# Altium project IPG.PrjPcb (part 7 of 13)

## Sheet 10-Sensing.SchDoc: Sensing
size A2; DocumentNumber: 10; SheetNumber: 10; SheetTotal: 15
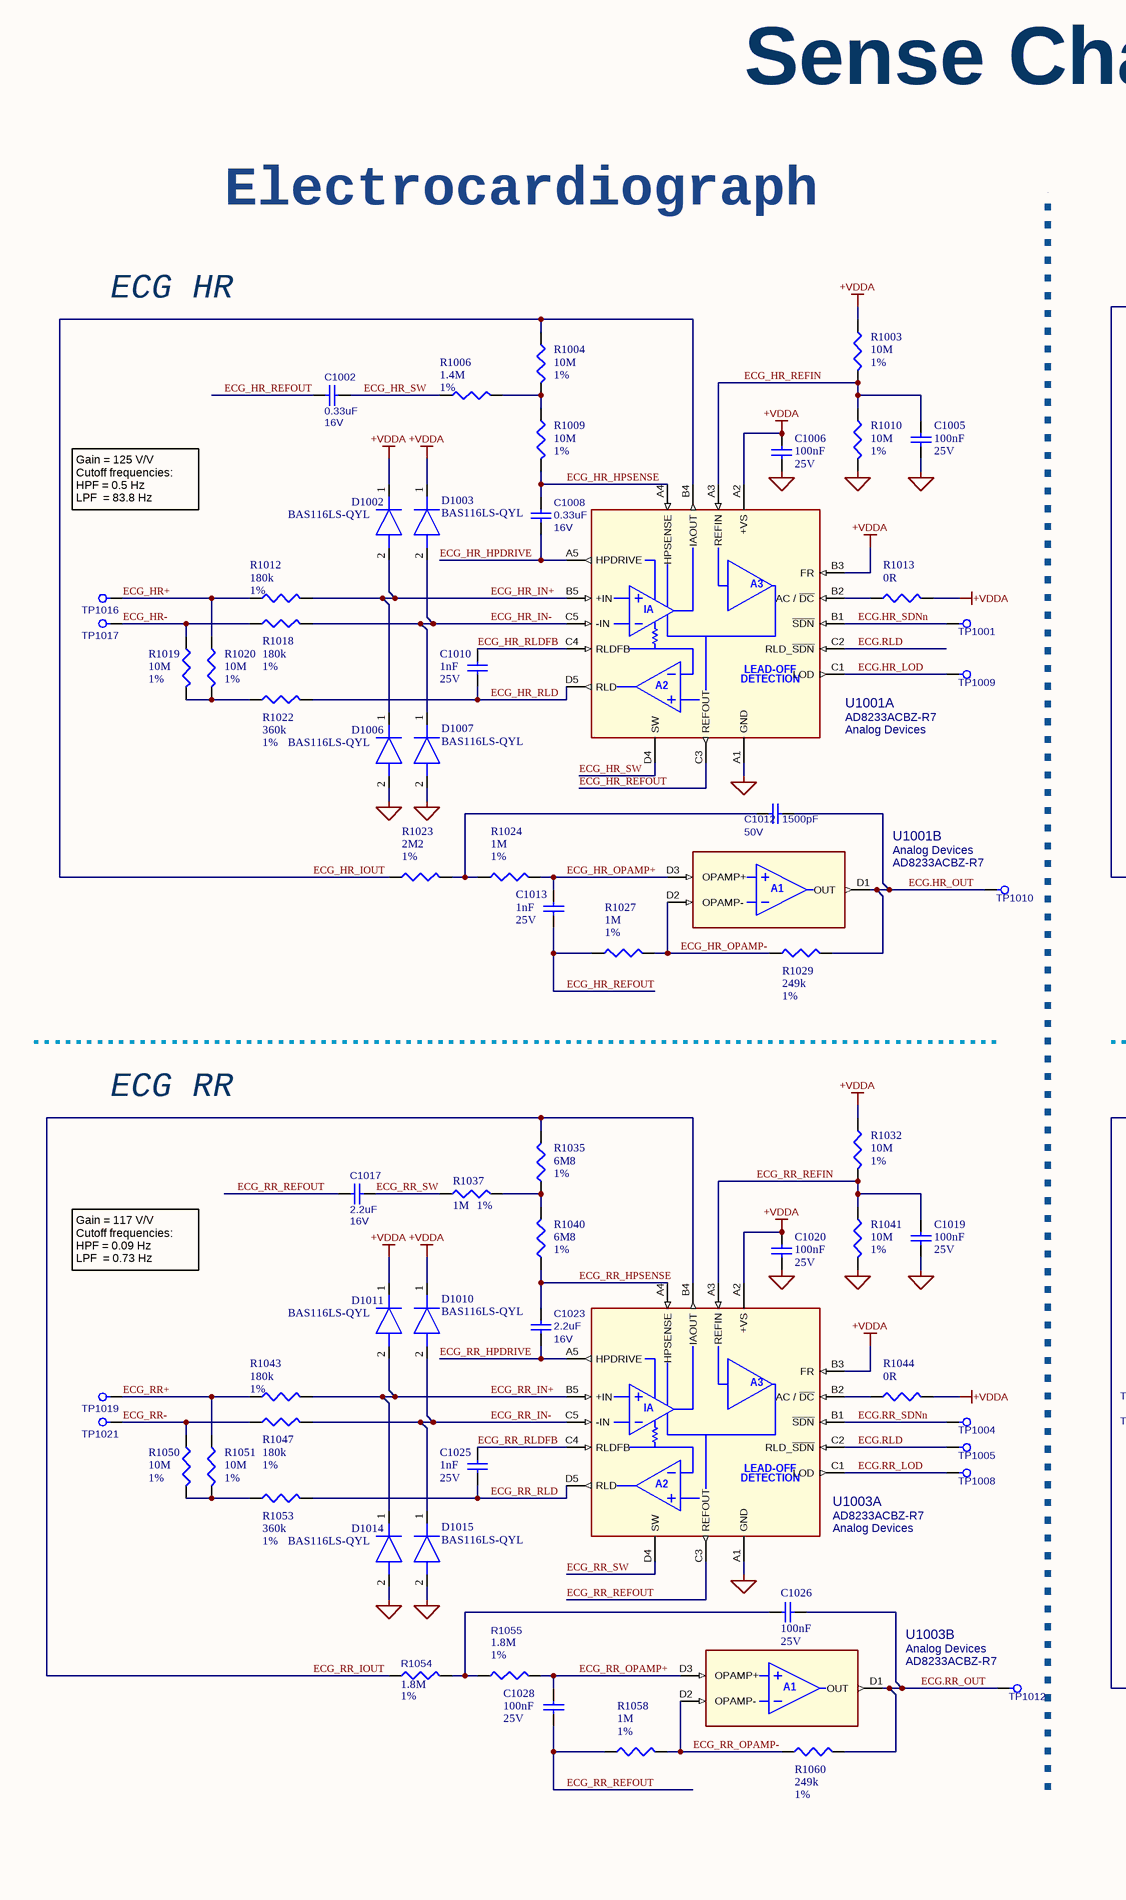
[diagram p21: 10-Sensing.SchDoc, left]
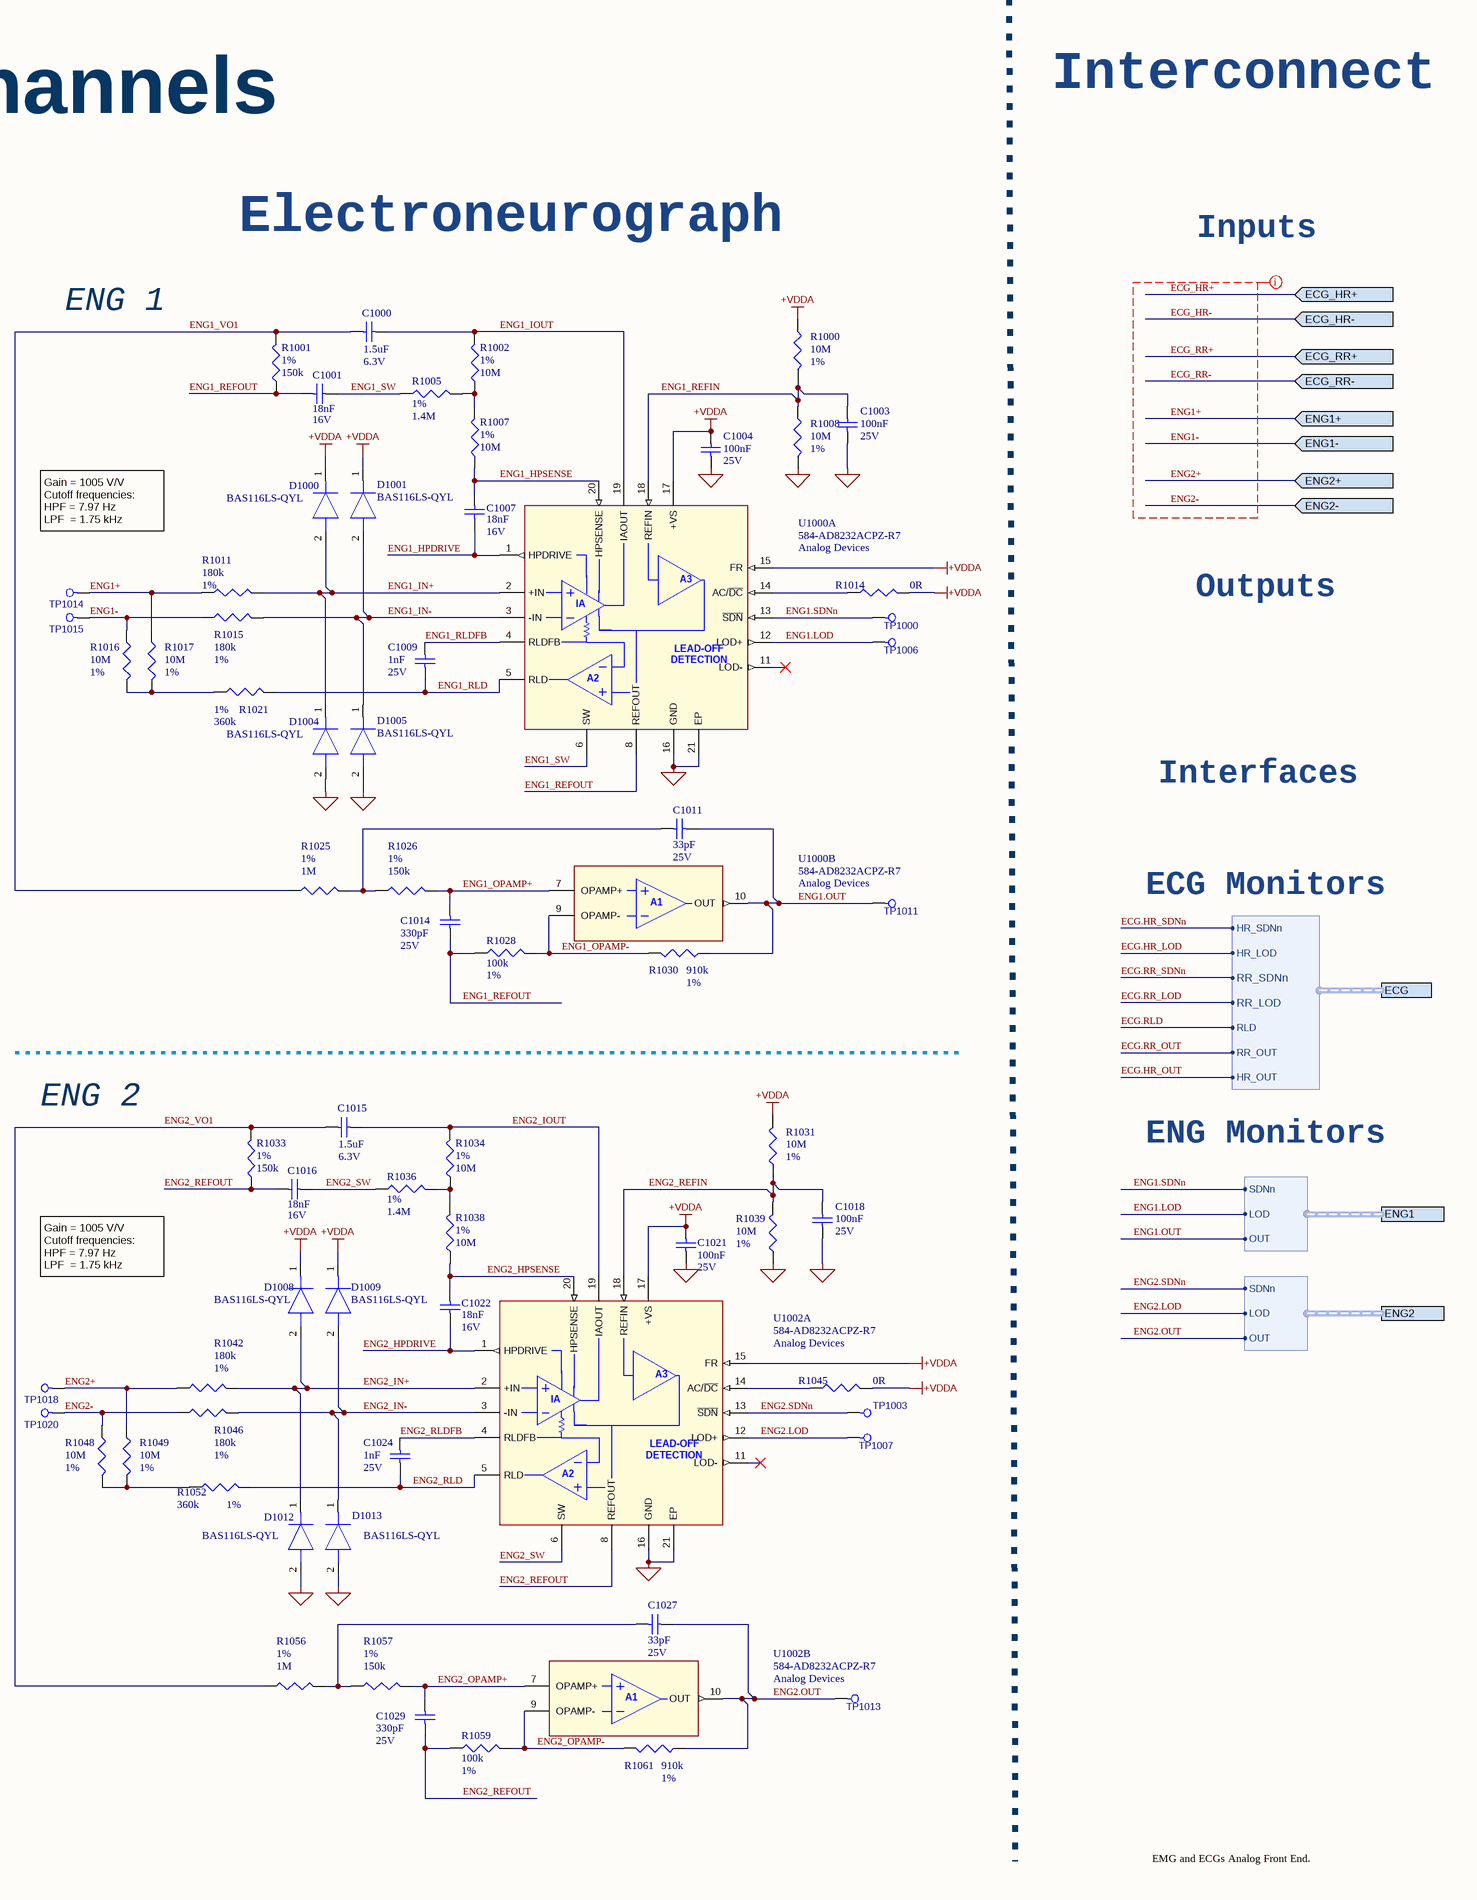
[diagram p22: 10-Sensing.SchDoc, right]

### Parts
C1000  value 1.5uF  Rated DC Voltage (URdc): 6.3V  [C0201_C]  (hidden comment: GRM033R60J155ME14D)
C1001  value 18nF  Rated DC Voltage (URdc): 16V  [C0201_C]  (hidden comment: GRM033R61C183KE84D)
C1002  value 0.33uF  Rating: 16V  [CAP0402_REDUCED]  (hidden comment: CGA2B1X7S1C334K050BC)
C1003  value 100nF  Rated DC Voltage (URdc): 25V  [C0201_C]  (hidden comment: GRM033R61E104KE14J)
C1004  value 100nF  Rated DC Voltage (URdc): 25V  [C0201_C]  (hidden comment: GRM033R61E104KE14J)
C1005  value 100nF  Rated DC Voltage (URdc): 25V  [C0201_C]  (hidden comment: GRM033R61E104KE14J)
C1006  value 100nF  Rated DC Voltage (URdc): 25V  [C0201_C]  (hidden comment: GRM033R61E104KE14J)
C1007  value 18nF  Rated DC Voltage (URdc): 16V  [C0201_C]  (hidden comment: GRM033R61C183KE84D)
C1008  value 0.33uF  Rating: 16V  [CAP0402_REDUCED]  (hidden comment: CGA2B1X7S1C334K050BC)
C1009  value 1nF  Rated DC Voltage (URdc): 25V  [C0201_C]  (hidden comment: GRM033R71E102KA01J)
C1010  value 1nF  Rated DC Voltage (URdc): 25V  [C0201_C]  (hidden comment: GRM033R71E102KA01J)
C1011  value 33pF  Rated DC Voltage (URdc): 25V  [C0201_C]  (hidden comment: GRM0335C1E330JA01D)
C1012  value 1500pF  Rating: 50V  [CAP0402_REDUCED]  (hidden comment: GCM155R71H152KA37D)
C1013  value 1nF  Rated DC Voltage (URdc): 25V  [C0201_C]  (hidden comment: GRM033R71E102KA01J)
C1014  value 330pF  Rated DC Voltage (URdc): 25V  [C0201_C]  (hidden comment: GRM033R71E331KA01D)
C1015  value 1.5uF  Rated DC Voltage (URdc): 6.3V  [C0201_C]  (hidden comment: GRM033R60J155ME14D)
C1016  value 18nF  Rated DC Voltage (URdc): 16V  [C0201_C]  (hidden comment: GRM033R61C183KE84D)
C1017  value 2.2uF  Rating: 16V  [CAP0603_REDUCED]  (hidden comment: GRM188Z71C225ME43J)
C1018  value 100nF  Rated DC Voltage (URdc): 25V  [C0201_C]  (hidden comment: GRM033R61E104KE14J)
C1019  value 100nF  Rated DC Voltage (URdc): 25V  [C0201_C]  (hidden comment: GRM033R61E104KE14J)
C1020  value 100nF  Rated DC Voltage (URdc): 25V  [C0201_C]  (hidden comment: GRM033R61E104KE14J)
C1021  value 100nF  Rated DC Voltage (URdc): 25V  [C0201_C]  (hidden comment: GRM033R61E104KE14J)
C1022  value 18nF  Rated DC Voltage (URdc): 16V  [C0201_C]  (hidden comment: GRM033R61C183KE84D)
C1023  value 2.2uF  Rating: 16V  [CAP0603_REDUCED]  (hidden comment: GRM188Z71C225ME43J)
C1024  value 1nF  Rated DC Voltage (URdc): 25V  [C0201_C]  (hidden comment: GRM033R71E102KA01J)
C1025  value 1nF  Rated DC Voltage (URdc): 25V  [C0201_C]  (hidden comment: GRM033R71E102KA01J)
C1026  value 100nF  Rated DC Voltage (URdc): 25V  [C0201_C]  (hidden comment: GRM033R61E104KE14J)
C1027  value 33pF  Rated DC Voltage (URdc): 25V  [C0201_C]  (hidden comment: GRM0335C1E330JA01D)
C1028  value 100nF  Rated DC Voltage (URdc): 25V  [C0201_C]  (hidden comment: GRM033R61E104KE14J)
C1029  value 330pF  Rated DC Voltage (URdc): 25V  [C0201_C]  (hidden comment: GRM033R71E331KA01D)
D1000  BAS116LS-QYL  [BAS116LSQYL]
D1001  BAS116LS-QYL  [BAS116LSQYL]
D1002  BAS116LS-QYL  [BAS116LSQYL]
D1003  BAS116LS-QYL  [BAS116LSQYL]
D1004  BAS116LS-QYL  [BAS116LSQYL]
D1005  BAS116LS-QYL  [BAS116LSQYL]
D1006  BAS116LS-QYL  [BAS116LSQYL]
D1007  BAS116LS-QYL  [BAS116LSQYL]
D1008  BAS116LS-QYL  [BAS116LSQYL]
D1009  BAS116LS-QYL  [BAS116LSQYL]
D1010  BAS116LS-QYL  [BAS116LSQYL]
D1011  BAS116LS-QYL  [BAS116LSQYL]
D1012  BAS116LS-QYL  [BAS116LSQYL]
D1013  BAS116LS-QYL  [BAS116LSQYL]
D1014  BAS116LS-QYL  [BAS116LSQYL]
D1015  BAS116LS-QYL  [BAS116LSQYL]
R1000  value 10M  Tolerance: 1%  [R0201_C]  (hidden comment: CRCW020110M0FNED)
R1001  value 150k  Tolerance: 1%  [R0201_C]  (hidden comment: CRCW0201150KFNED)
R1002  value 10M  Tolerance: 1%  [R0201_C]  (hidden comment: CRCW020110M0FNED)
R1003  value 10M  Tolerance: 1%  [R0201_C]  (hidden comment: CRCW020110M0FNED)
R1004  value 10M  Tolerance: 1%  [R0201_C]  (hidden comment: CRCW020110M0FNED)
R1005  value 1.4M  Tolerance: 1%  [R0201_C]  (hidden comment: CRCW02011M40FNED)
R1006  value 1.4M  Tolerance: 1%  [R0201_C]  (hidden comment: CRCW02011M40FNED)
R1007  value 10M  Tolerance: 1%  [R0201_C]  (hidden comment: CRCW020110M0FNED)
R1008  value 10M  Tolerance: 1%  [R0201_C]  (hidden comment: CRCW020110M0FNED)
R1009  value 10M  Tolerance: 1%  [R0201_C]  (hidden comment: CRCW020110M0FNED)
R1010  value 10M  Tolerance: 1%  [R0201_C]  (hidden comment: CRCW020110M0FNED)
R1011  value 180k  Tolerance: 1%  [R0201_C]  (hidden comment: CRCW0201180KFNED)
R1012  value 180k  Tolerance: 1%  [R0201_C]  (hidden comment: CRCW0201180KFNED)
R1013  value 0R  [R0201_C]  (hidden comment: CRCW02010000Z0ED)
R1014  value 0R  [R0201_C]  (hidden comment: CRCW02010000Z0ED)
R1015  value 180k  Tolerance: 1%  [R0201_C]  (hidden comment: CRCW0201180KFNED)
R1016  value 10M  Tolerance: 1%  [R0201_C]  (hidden comment: CRCW020110M0FNED)
R1017  value 10M  Tolerance: 1%  [R0201_C]  (hidden comment: CRCW020110M0FNED)
R1018  value 180k  Tolerance: 1%  [R0201_C]  (hidden comment: CRCW0201180KFNED)
R1019  value 10M  Tolerance: 1%  [R0201_C]  (hidden comment: CRCW020110M0FNED)
R1020  value 10M  Tolerance: 1%  [R0201_C]  (hidden comment: CRCW020110M0FNED)
R1021  value 360k  Tolerance: 1%  [R0201_C]  (hidden comment: CRCW0201360KFNED)
R1022  value 360k  Tolerance: 1%  [R0201_C]  (hidden comment: CRCW0201360KFNED)
R1023  value 2M2  Tolerance: 1%  [R0201_C]  (hidden comment: CRCW02012M20FNED)
R1024  value 1M  Tolerance: 1%  [R0201_C]  (hidden comment: CRCW02011M00FNED)
R1025  value 1M  Tolerance: 1%  [R0201_C]  (hidden comment: CRCW02011M00FNED)
R1026  value 150k  Tolerance: 1%  [R0201_C]  (hidden comment: CRCW0201150KFNED)
R1027  value 1M  Tolerance: 1%  [R0201_C]  (hidden comment: CRCW02011M00FNED)
R1028  value 100k  Tolerance: 1%  [R0201_C]  (hidden comment: CRCW0201100KFNED)
R1029  value 249k  Tolerance: 1%  [R0201_C]  (hidden comment: CRCW0201249KFNED)
R1030  value 910k  Tolerance: 1%  [R0201_C]  (hidden comment: CRCW0201910KFNED)
R1031  value 10M  Tolerance: 1%  [R0201_C]  (hidden comment: CRCW020110M0FNED)
R1032  value 10M  Tolerance: 1%  [R0201_C]  (hidden comment: CRCW020110M0FNED)
R1033  value 150k  Tolerance: 1%  [R0201_C]  (hidden comment: CRCW0201150KFNED)
R1034  value 10M  Tolerance: 1%  [R0201_C]  (hidden comment: CRCW020110M0FNED)
R1035  value 6M8  Tolerance: 1%  [R0201_C]  (hidden comment: CRCW02016M80FNED)
R1036  value 1.4M  Tolerance: 1%  [R0201_C]  (hidden comment: CRCW02011M40FNED)
R1037  value 1M  Tolerance: 1%  [R0201_C]  (hidden comment: CRCW02011M00FNED)
R1038  value 10M  Tolerance: 1%  [R0201_C]  (hidden comment: CRCW020110M0FNED)
R1039  value 10M  Tolerance: 1%  [R0201_C]  (hidden comment: CRCW020110M0FNED)
R1040  value 6M8  Tolerance: 1%  [R0201_C]  (hidden comment: CRCW02016M80FNED)
R1041  value 10M  Tolerance: 1%  [R0201_C]  (hidden comment: CRCW020110M0FNED)
R1042  value 180k  Tolerance: 1%  [R0201_C]  (hidden comment: CRCW0201180KFNED)
R1043  value 180k  Tolerance: 1%  [R0201_C]  (hidden comment: CRCW0201180KFNED)
R1044  value 0R  [R0201_C]  (hidden comment: CRCW02010000Z0ED)
R1045  value 0R  [R0201_C]  (hidden comment: CRCW02010000Z0ED)
R1046  value 180k  Tolerance: 1%  [R0201_C]  (hidden comment: CRCW0201180KFNED)
R1047  value 180k  Tolerance: 1%  [R0201_C]  (hidden comment: CRCW0201180KFNED)
R1048  value 10M  Tolerance: 1%  [R0201_C]  (hidden comment: CRCW020110M0FNED)
R1049  value 10M  Tolerance: 1%  [R0201_C]  (hidden comment: CRCW020110M0FNED)
R1050  value 10M  Tolerance: 1%  [R0201_C]  (hidden comment: CRCW020110M0FNED)
R1051  value 10M  Tolerance: 1%  [R0201_C]  (hidden comment: CRCW020110M0FNED)
R1052  value 360k  Tolerance: 1%  [R0201_C]  (hidden comment: CRCW0201360KFNED)
R1053  value 360k  Tolerance: 1%  [R0201_C]  (hidden comment: CRCW0201360KFNED)
R1054  value 1.8M  Precision: 1%  [R0201_C]  (hidden comment: RC0201FR-071M8L)
R1055  value 1.8M  Precision: 1%  [R0201_C]  (hidden comment: RC0201FR-071M8L)
R1056  value 1M  Tolerance: 1%  [R0201_C]  (hidden comment: CRCW02011M00FNED)
R1057  value 150k  Tolerance: 1%  [R0201_C]  (hidden comment: CRCW0201150KFNED)
R1058  value 1M  Tolerance: 1%  [R0201_C]  (hidden comment: CRCW02011M00FNED)
R1059  value 100k  Tolerance: 1%  [R0201_C]  (hidden comment: CRCW0201100KFNED)
R1060  value 249k  Tolerance: 1%  [R0201_C]  (hidden comment: CRCW0201249KFNED)
R1061  value 910k  Tolerance: 1%  [R0201_C]  (hidden comment: CRCW0201910KFNED)
TP1000  Test Point  [testpad_0.9mm]  (value not drawn)  (no BOM)
TP1001  Test Point  [testpad_0.9mm]  (value not drawn)  (no BOM)
TP1003  Test Point  [testpad_0.9mm]  (value not drawn)  (no BOM)
TP1004  Test Point  [testpad_0.9mm]  (value not drawn)  (no BOM)
TP1005  Test Point  [testpad_0.9mm]  (value not drawn)  (no BOM)
TP1006  Test Point  [testpad_0.9mm]  (value not drawn)  (no BOM)
TP1007  Test Point  [testpad_0.9mm]  (value not drawn)  (no BOM)
TP1008  Test Point  [testpad_0.9mm]  (value not drawn)  (no BOM)
TP1009  Test Point  [testpad_0.9mm]  (value not drawn)  (no BOM)
TP1010  Test Point  [testpad_0.9mm]  (value not drawn)  (no BOM)
TP1011  Test Point  [testpad_0.9mm]  (value not drawn)  (no BOM)
TP1012  Test Point  [testpad_0.9mm]  (value not drawn)  (no BOM)
TP1013  Test Point  [testpad_0.9mm]  (value not drawn)  (no BOM)
TP1014  Test Point  [testpad_0.9mm]  (value not drawn)  (no BOM)
TP1015  Test Point  [testpad_0.9mm]  (value not drawn)  (no BOM)
TP1016  Test Point  [testpad_0.9mm]  (value not drawn)  (no BOM)
TP1017  Test Point  [testpad_0.9mm]  (value not drawn)  (no BOM)
TP1018  Test Point  [testpad_0.9mm]  (value not drawn)  (no BOM)
TP1019  Test Point  [testpad_0.9mm]  (value not drawn)  (no BOM)
TP1020  Test Point  [testpad_0.9mm]  (value not drawn)  (no BOM)
TP1021  Test Point  [testpad_0.9mm]  (value not drawn)  (no BOM)
U1000  Supplier Part Number: 584-AD8232ACPZ-R7  Manufacturer: Analog Devices  [FP-CP-20-8-IPC_C]  (hidden comment: AD8232ACPZ-R7)  (parts A,B of 2)
U1001  Manufacturer: Analog Devices  [AD8233ACBZ-R7]  (hidden comment: AD8233ACBZ-R7)  (parts A,B of 2)
U1002  Supplier Part Number: 584-AD8232ACPZ-R7  Manufacturer: Analog Devices  [FP-CP-20-8-IPC_C]  (hidden comment: AD8232ACPZ-R7)  (parts A,B of 2)
U1003  Manufacturer: Analog Devices  [AD8233ACBZ-R7]  (hidden comment: AD8233ACBZ-R7)  (parts A,B of 2)

### Ports
ECG (harness ECG), ECG_HR+ (in), ECG_HR- (in), ECG_RR+ (in), ECG_RR- (in), ENG1 (harness EMG), ENG1+ (in), ENG1- (in), ENG2 (harness EMG), ENG2+ (in), ENG2- (in)

### Harnesses
ECG: HR_SDNn, RLD, HR_LOD, HR_OUT, RR_SDNn, RR_LOD, RR_OUT
EMG: SDNn, LOD, OUT

### Nets
+VDDA: C1004.2 C1006.2 C1020.2 C1021.1 D1000.1(K) D1001.1(K) D1002.1(K) D1003.1(K) D1008.1(K) D1009.1(K) D1010.1(K) D1011.1(K) R1000.1 R1003.1 R1013.2 R1014.2 R1031.2 R1032.1 R1044.2 R1045.2 U1000.15(FR) U1000.17(+VS) U1001.A2(+VS) U1001.B3(FR) U1002.15(FR) U1002.17(+VS) U1003.A2(+VS) U1003.B3(FR)
GND: C1003.1 C1004.1 C1005.1 C1006.1 C1018.2 C1019.1 C1020.1 C1021.2 D1004.2(A) D1005.2(A) D1006.2(A) D1007.2(A) D1012.2(A) D1013.2(A) D1014.2(A) D1015.2(A) R1008.2 R1010.2 R1039.1 R1041.2 U1000.16(GND) U1000.21(EP) U1001.A1(GND) U1002.16(GND) U1002.21(EP) U1003.A1(GND)
ECG.HR_LOD: TP1009.1 U1001.C1(LOD) ; port ECG.HR_LOD
ECG.HR_OUT: C1012.1 R1029.2 TP1010.1 U1001.D1(OUT) ; port ECG.HR_OUT
ECG.HR_SDNn: TP1001.1 U1001.B1(~{SDN}) ; port ECG.HR_SDNn
ECG.RLD: TP1005.1 U1001.C2(RLD_~{SDN}) U1003.C2(RLD_~{SDN}) ; port ECG.RLD
ECG.RR_LOD: TP1008.1 U1003.C1(LOD) ; port ECG.RR_LOD
ECG.RR_OUT: C1026.1 R1060.2 TP1012.1 U1003.D1(OUT) ; port ECG.RR_OUT
ECG.RR_SDNn: TP1004.1 U1003.B1(~{SDN}) ; port ECG.RR_SDNn
ECG_HR+: R1012.1 R1020.1 TP1016.1 ; port ECG_HR+
ECG_HR-: R1018.1 R1019.1 TP1017.1 ; port ECG_HR-
ECG_HR_HPDRIVE: C1008.1 U1001.A5(HPDRIVE)
ECG_HR_HPSENSE: C1008.2 R1009.2 U1001.A4(HPSENSE)
ECG_HR_IN+: D1002.2(A) D1006.1(K) R1012.2 U1001.B5(+IN)
ECG_HR_IN-: D1003.2(A) D1007.1(K) R1018.2 U1001.C5(-IN)
ECG_HR_IOUT: R1004.1 R1023.1 U1001.B4(IAOUT)
ECG_HR_OPAMP+: C1013.2 R1024.2 U1001.D3(OPAMP+)
ECG_HR_OPAMP-: R1027.2 R1029.1 U1001.D2(OPAMP-)
ECG_HR_REFIN: C1005.2 R1003.2 R1010.1 U1001.A3(REFIN)
ECG_HR_REFOUT: C1002.1 C1013.1 R1027.1 U1001.C3(REFOUT)
ECG_HR_RLD: C1010.1 R1022.2 U1001.D5(RLD)
ECG_HR_RLDFB: C1010.2 U1001.C4(RLDFB)
ECG_HR_SW: C1002.2 R1006.1 U1001.D4(SW)
ECG_RR+: R1043.1 R1051.1 TP1019.1 ; port ECG_RR+
ECG_RR-: R1047.1 R1050.1 TP1021.1 ; port ECG_RR-
ECG_RR_HPDRIVE: C1023.1 U1003.A5(HPDRIVE)
ECG_RR_HPSENSE: C1023.2 R1040.1 U1003.A4(HPSENSE)
ECG_RR_IN+: D1011.2(A) D1014.1(K) R1043.2 U1003.B5(+IN)
ECG_RR_IN-: D1010.2(A) D1015.1(K) R1047.2 U1003.C5(-IN)
ECG_RR_IOUT: R1035.2 R1054.1 U1003.B4(IAOUT)
ECG_RR_OPAMP+: C1028.2 R1055.2 U1003.D3(OPAMP+)
ECG_RR_OPAMP-: R1058.2 R1060.1 U1003.D2(OPAMP-)
ECG_RR_REFIN: C1019.2 R1032.2 R1041.1 U1003.A3(REFIN)
ECG_RR_REFOUT: C1017.2 C1028.1 R1058.1 U1003.C3(REFOUT)
ECG_RR_RLD: C1025.1 R1053.2 U1003.D5(RLD)
ECG_RR_RLDFB: C1025.2 U1003.C4(RLDFB)
ECG_RR_SW: C1017.1 R1037.1 U1003.D4(SW)
ENG1+: R1011.1 R1017.1 TP1014.1 ; port ENG1+
ENG1-: R1015.1 R1016.1 TP1015.1 ; port ENG1-
ENG1.LOD: TP1006.1 U1000.12(LOD+) ; port ENG1.LOD
ENG1.OUT: C1011.2 R1030.1 TP1011.1 U1000.10(OUT) ; port ENG1.OUT
ENG1.SDNn: TP1000.1 U1000.13(~{SDN}) ; port ENG1.SDNn
ENG1_HPDRIVE: C1007.1 U1000.1(HPDRIVE)
ENG1_HPSENSE: C1007.2 R1007.1 U1000.20(HPSENSE)
ENG1_IN+: D1000.2(A) D1004.1(K) R1011.2 U1000.2(+IN)
ENG1_IN-: D1001.2(A) D1005.1(K) R1015.2 U1000.3(-IN)
ENG1_IOUT: C1000.2 R1002.2 U1000.19(IAOUT)
ENG1_OPAMP+: C1014.2 R1026.2 U1000.7(OPAMP+)
ENG1_OPAMP-: R1028.2 R1030.2 U1000.9(OPAMP-)
ENG1_REFIN: C1003.2 R1000.2 R1008.1 U1000.18(REFIN)
ENG1_REFOUT: C1001.2 C1014.1 R1001.1 R1028.1 U1000.8(REFOUT)
ENG1_RLD: C1009.1 R1021.2 U1000.5(RLD)
ENG1_RLDFB: C1009.2 U1000.4(RLDFB)
ENG1_SW: C1001.1 R1005.1 U1000.6(SW)
ENG1_VO1: C1000.1 R1001.2 R1025.1
ENG2+: R1042.1 R1049.1 TP1018.1 ; port ENG2+
ENG2-: R1046.1 R1048.1 TP1020.1 ; port ENG2-
ENG2.LOD: TP1007.1 U1002.12(LOD+) ; port ENG2.LOD
ENG2.OUT: C1027.2 R1061.1 TP1013.1 U1002.10(OUT) ; port ENG2.OUT
ENG2.SDNn: TP1003.1 U1002.13(~{SDN}) ; port ENG2.SDNn
ENG2_HPDRIVE: C1022.1 U1002.1(HPDRIVE)
ENG2_HPSENSE: C1022.2 R1038.1 U1002.20(HPSENSE)
ENG2_IN+: D1008.2(A) D1012.1(K) R1042.2 U1002.2(+IN)
ENG2_IN-: D1009.2(A) D1013.1(K) R1046.2 U1002.3(-IN)
ENG2_IOUT: C1015.2 R1034.2 U1002.19(IAOUT)
ENG2_OPAMP+: C1029.2 R1057.2 U1002.7(OPAMP+)
ENG2_OPAMP-: R1059.2 R1061.2 U1002.9(OPAMP-)
ENG2_REFIN: C1018.1 R1031.1 R1039.2 U1002.18(REFIN)
ENG2_REFOUT: C1016.2 C1029.1 R1033.1 R1059.1 U1002.8(REFOUT)
ENG2_RLD: C1024.1 R1052.2 U1002.5(RLD)
ENG2_RLDFB: C1024.2 U1002.4(RLDFB)
ENG2_SW: C1016.1 R1036.1 U1002.6(SW)
ENG2_VO1: C1015.1 R1033.2 R1056.1
NetC1011_1: C1011.1 R1025.2 R1026.1
NetC1012_2: C1012.2 R1023.2 R1024.1
NetC1026_2: C1026.2 R1054.2 R1055.1
NetC1027_1: C1027.1 R1056.2 R1057.1
NetR1002_1: R1002.1 R1005.2 R1007.2
NetR1004_2: R1004.2 R1006.2 R1009.1
NetR1013_1: R1013.1 U1001.B2(AC_/_~{DC})
NetR1014_1: R1014.1 U1000.14(AC/~{DC})
NetR1016_2: R1016.2 R1017.2 R1021.1
NetR1019_2: R1019.2 R1020.2 R1022.1
NetR1034_1: R1034.1 R1036.2 R1038.2
NetR1035_1: R1035.1 R1037.2 R1040.2
NetR1044_1: R1044.1 U1003.B2(AC_/_~{DC})
NetR1045_1: R1045.1 U1002.14(AC/~{DC})
NetR1048_2: R1048.2 R1049.2 R1052.1
NetR1050_2: R1050.2 R1051.2 R1053.1

Not connected (* = marked no-connect by the designer): U1000 11(LOD-)*; U1002 11(LOD-)*

### Layout directives
net class ANALOG: ECG_HR+, ECG_HR-, ECG_RR+, ECG_RR-, ENG1+, ENG1-, ENG2+, ENG2-

### Notes on the sheet
- Sense Channels
- Interconnect
- Electrocardiograph
- Electroneurograph
- Inputs
- ENG 1
- ECG HR
- Gain = 125 V/V
  Cutoff frequencies:
  HPF = 0.5 Hz
  LPF  = 83.8 Hz
- Gain = 1005 V/V
  Cutoff frequencies:
  HPF = 7.97 Hz
  LPF  = 1.75 kHz
- Outputs
- Interfaces
- ECG Monitors
- ECG RR
- ENG 2
- ENG Monitors
- Gain = 117 V/V
  Cutoff frequencies:
  HPF = 0.09 Hz
  LPF  = 0.73 Hz
- EMG and ECGs Analog Front End.
- Project:
- Schematic:
- Design by:
- Date:
- Ver:
- .
- Comments:
- Reviewed by:
- (in symbol AD8232ACPZ-R7, part A) A3; IA; LEAD-OFF; DETECTION; A2
- (in symbol AD8232ACPZ-R7, part B) A1
- (in symbol AD8233ACBZ-R7, part A) IA; LEAD-OFF; DETECTION